# EAGLE design shield-ant (EAGLE 5.06)
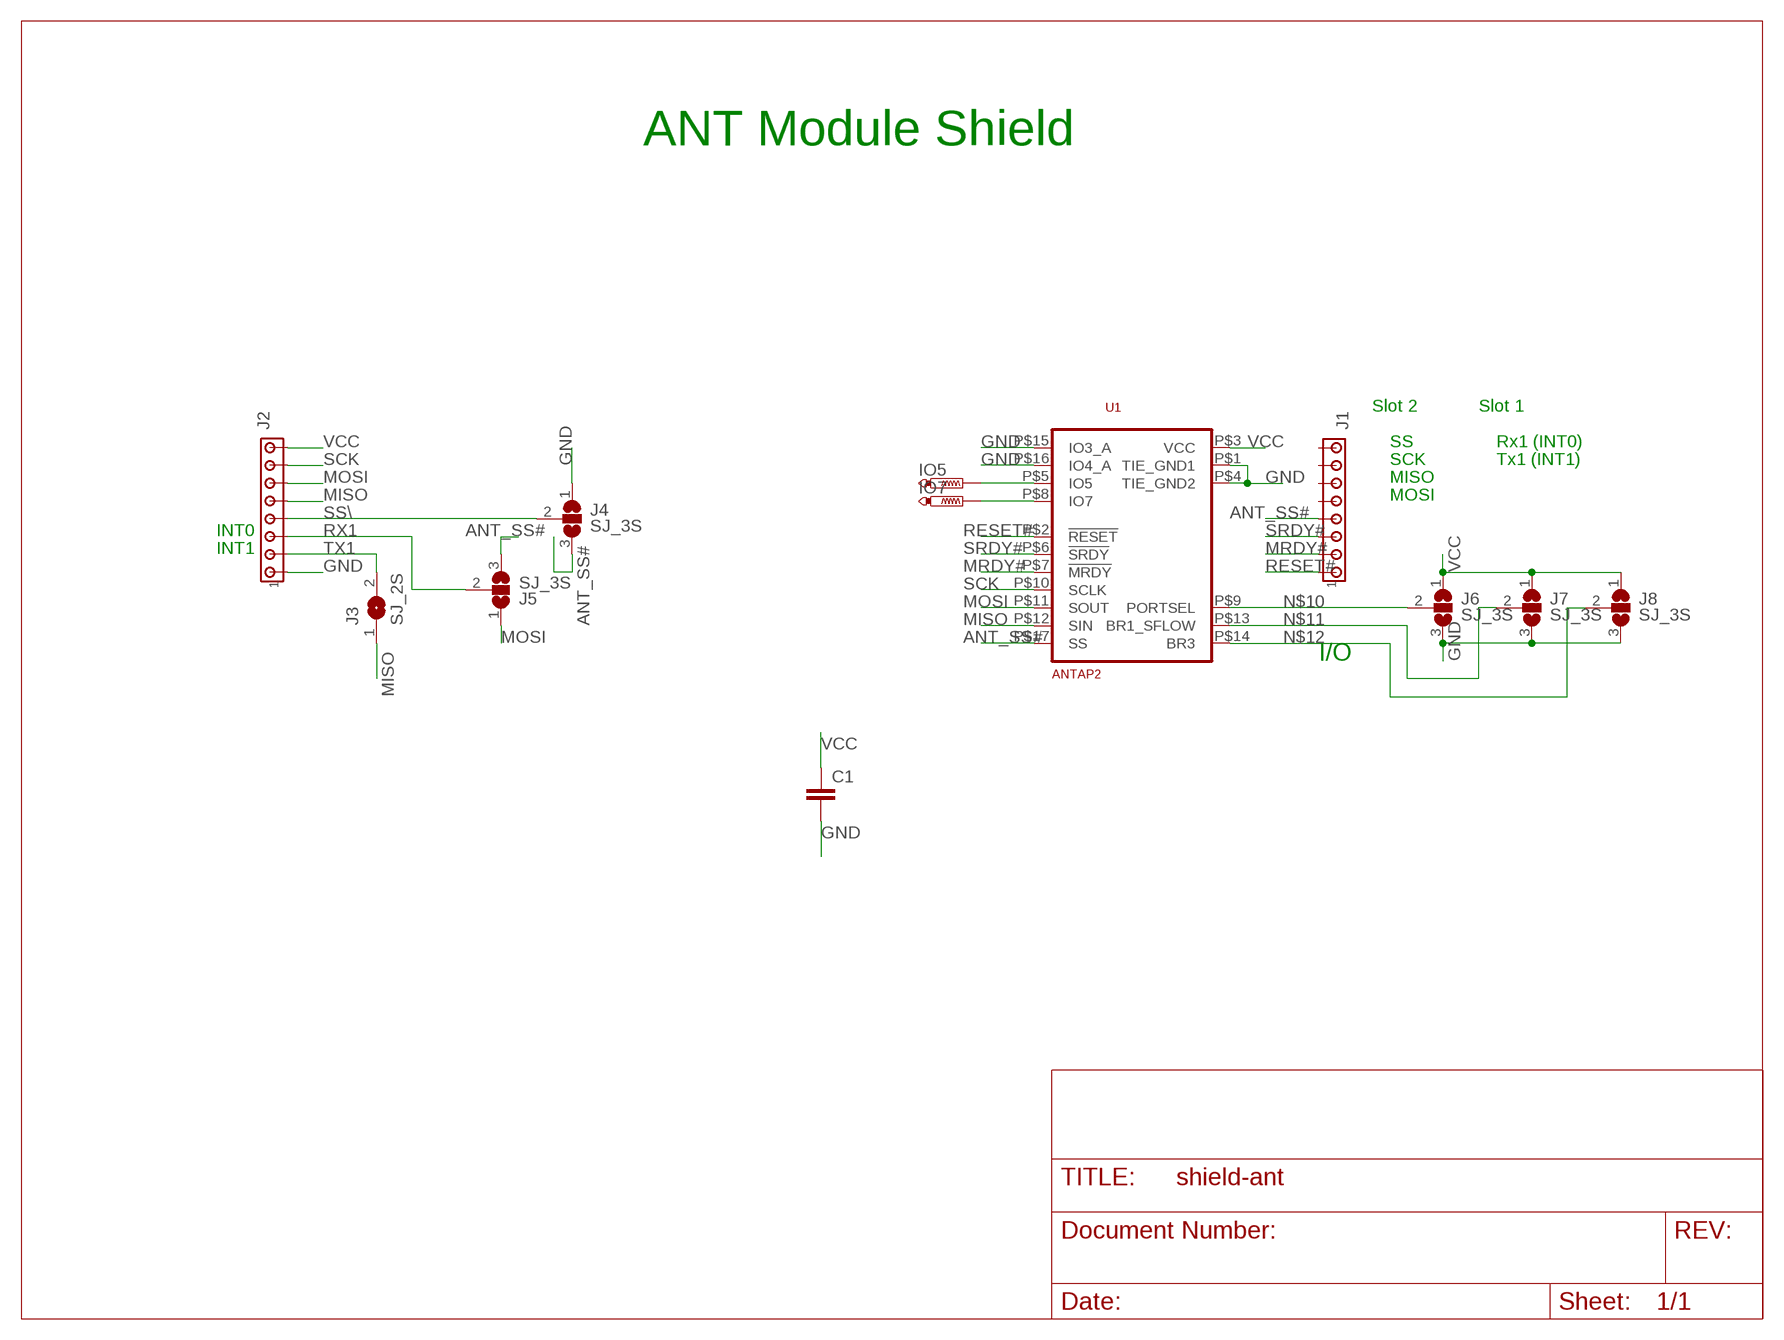
[diagram p0: schematic, sheet 1]

## Parts
C1  C-EUC0805  [C0805]
IO5  PTR1TP15R  [TP15R]
IO7  PTR1TP15R  [TP15R]
J1  MTA08-100  [10X08MTA]
J2  MTA08-100  [10X08MTA]
J3  SJ_2S  [SJ2_S]
J4  SJ_3S  [SJ3_S]
J5  SJ_3S  [SJ3_S]
J6  SJ_3S  [SJ3_S]
J7  SJ_3S  [SJ3_S]
J8  SJ_3S  [SJ3_S]
U1  ANTAP2  ANT21TRXXX  [ANT21TRX3M4_SMD_RESTRICT]

## Nets
ANT_SS#: J1.4 J4.3 J5.3 U1.P$17(SS)
GND: C1.2 J2.1 J4.1 J6.3 J7.3 J8.3 U1.P$1(TIE_GND1) U1.P$4(TIE_GND2) U1.P$15(IO3_A) U1.P$16(IO4_A)
MISO: J2.5 J3.1 U1.P$12(SIN)
MOSI: J2.6 J5.1 U1.P$11(SOUT)
MRDY#: J1.2 U1.P$7(!MRDY)
N$1: IO7.TP U1.P$8(IO7)
N$2: IO5.TP U1.P$5(IO5)
N$10: J6.2 U1.P$9(PORTSEL)
N$11: J7.2 U1.P$13(BR1_SFLOW)
N$12: J8.2 U1.P$14(BR3)
RESET#: J1.1 U1.P$2(!RESET)
RX1: J2.3 J5.2
SCK: J2.7 U1.P$10(SCLK)
SRDY#: J1.3 U1.P$6(!SRDY)
SS\: J2.4 J4.2
TX1: J2.2 J3.2
VCC: C1.1 J2.8 J6.1 J7.1 J8.1 U1.P$3(VCC)
Unconnected: J1.5 J1.6 J1.7 J1.8

## Notes on the sheet
- ANT Module Shield
- Slot 2 | Slot 1
- SS | Rx1 (INT0)
- SCK | Tx1 (INT1)
- MISO
- MOSI
- INT0
- INT1
- I/O

## Library data of the parts
C1 = rcl:C-EU: CAPACITOR, European symbol
IO5 IO7 = testpad:PTR1: TEST PIN
J1 J2 = con-amp:MTA08-100: AMP connector
J3 = mideeval:SJ_2S: Small solder jumper, 2 pin. 20060130 / tgipson
J4-J8 = mideeval:SJ_3S: Small solder jumper, 3 pin. 20060130 / tgipson
U1 = mideeval:ANT21TRXXX

## Net classes
1 pwr: width 0.305 mm, drill 0.508 mm, clearance 0.203 mm
4 digital: width 0.203 mm, drill 0.381 mm, clearance 0.203 mm

## Board
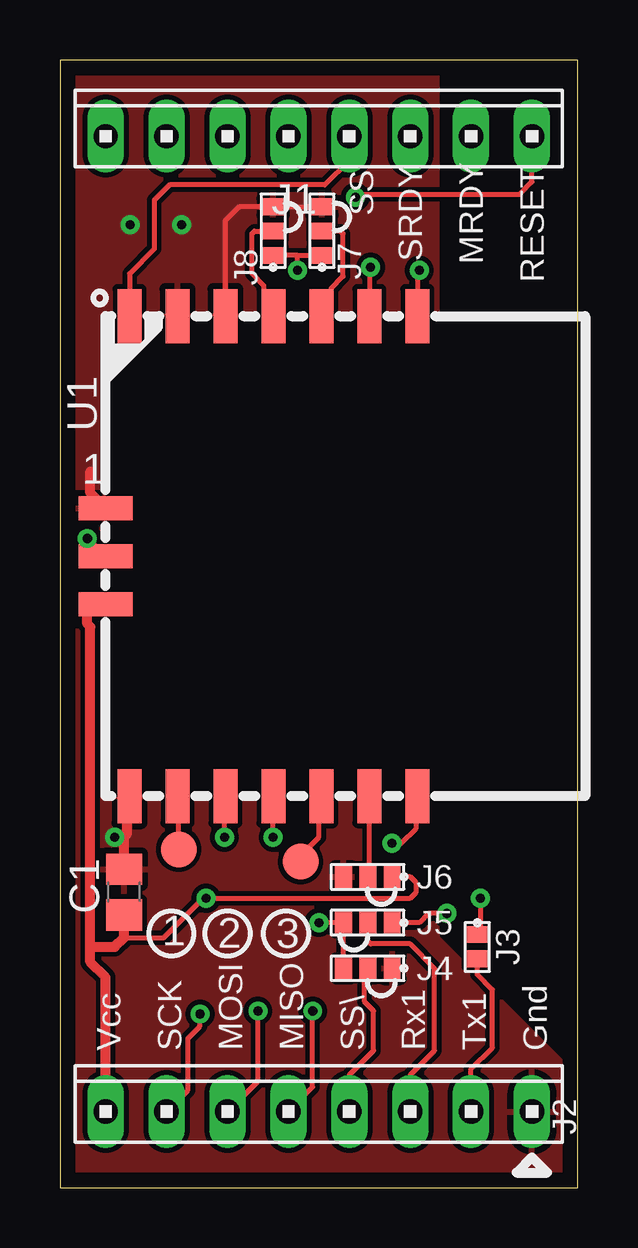
[diagram p1: board, top side]
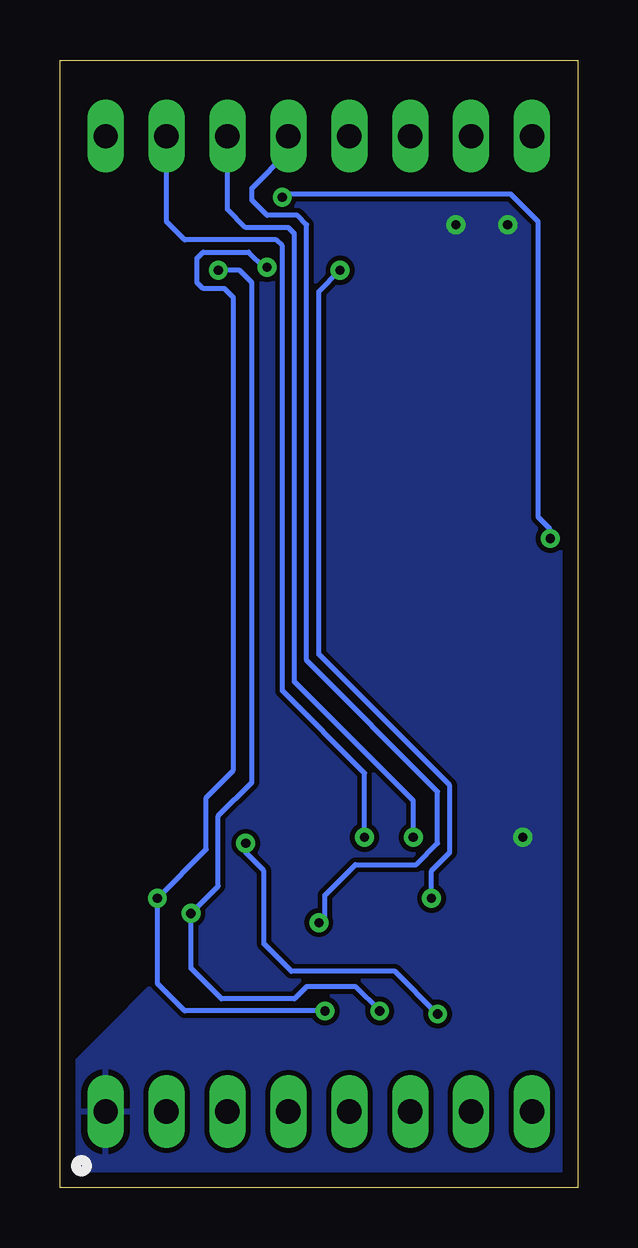
[diagram p2: board, bottom side, seen from below]

Size 21.59 x 46.99 mm. Coordinates in mm from the lower left corner, seen from the top.
Outline: 0,0 21.59,0 21.59,46.99 0,46.99 0,0
Copper layers (1*16): Top 0.035mm / dielectric 1.5mm / Bottom 0.035mm
Design rules "default *": minimum track width 8mil, minimum drill 15mil, track to track 8mil, track to pad 8mil, pad to pad 8mil, via to via 8mil, smd to smd 8mil, copper to edge 25mil, drill to drill 8mil, minimum pad ring 10mil, minimum via ring 8mil, stop-mask expansion 4mil, vias tented up to drill 0mil, thermal gap 10mil

### Footprints (pad centres in the part's own frame; a part is rotated, then mirrored left to right if it is on the bottom)
C0805 = smd 1.3 x 1.5: 1 -0.95,0; 2 0.95,0
TP15R = smd 1.5 x 1.5: TP 0,0
10X08MTA = drill 1.016 long: 1 8.89,0; 2 6.35,0; 3 3.81,0; 4 1.27,0; 5 -1.27,0; 6 -3.81,0; 7 -6.35,0; 8 -8.89,0
SJ2_S = smd 0.7 x 0.9: 1 -0.523,0; 2 0.493,0
SJ3_S = smd 0.7 x 0.9: 1 -1.031,0; 2 -0.015,0; 3 1.001,0
ANT21TRX3M4_SMD_RESTRICT = smd 2.25 x 1: P$1 0,-8; P$2 0,-10; P$3 0,-12 | smd 1 x 2.25: P$4 1,-20; P$5 3,-20; P$6 5,-20; P$7 7,-20; P$8 9,-20; P$9 11,-20; P$10 13,-20; P$11 13,0; P$12 11,0; P$13 9,0; P$14 7,0; P$15 5,0; P$16 3,0; P$17 1,0

### Placement (x,y rotation side)
C1  2.67,12.32 90 top
IO5  4.95,14.1 0 top
IO7  10.03,13.59 0 top
J1  10.79,43.81 0 top
J2  10.79,3.17 0 top
J3  17.4,10.03 270 top
J4  12.83,9.14 180 top
J5  12.83,11.05 180 top
J6  12.83,12.95 180 top
J7  10.92,39.88 90 top
J8  8.89,39.88 90 top
U1  1.91,36.32 0 top

### Tracks (layer width: path | path; a pad name or v marks a point on that pad's centre or on a via)
ANT_SS#  (via drill 0.38)
  Top 0.203: J1.4 12.06,42.8 11.05,41.78 4.57,41.78 3.94,41.15 3.94,39.12 2.9,38.08 U1.P$17 | J4.3 J5.3 v10.79,11.05
  Bottom 0.203: v10.79,11.05 10.54,11.3 10.54,12.19 9.27,13.46 6.73,13.46 5.84,14.35 5.84,16.51 11.3,21.97 11.3,40.13 11.68,40.51 12.95,40.51 13.59,41.15 13.59,41.66 12.06,43.18 J1.4
GND  (via drill 0.38)
  Top 0.203: J7.3 J8.3 8.88,40.89 7.49,40.89 6.91,40.31 U1.P$15
  Top 0.406: C1.2 2.67,14.61 2.79,14.73 2.79,16.21 U1.P$4 | U1.P$1 1.27,28.96 1.27,29.84
  other vias: 2.92,40.13 5.08,40.13 2.29,14.61
  pour Top: 0,0 21.59,0 21.59,4.57 15.75,10.41 15.75,46.99 0,46.99
  pour Bottom: 0,0 21.59,0 21.59,4.57 15.75,10.41 15.75,46.99 0,46.99
MISO  (via drill 0.38)
  Top 0.203: J3.1 17.53,10.68 v17.53,12.06 | J2.5 10.54,4.19 v10.54,7.37 | v12.95,38.35 12.9,38.05 U1.P$12
  Bottom 0.203: v10.54,7.37 16.38,7.37 17.53,8.51 v17.53,12.06 15.49,14.1 15.49,16.26 14.35,17.4 14.35,37.08 14.73,37.47 15.62,37.47 15.88,37.72 15.88,38.73 15.62,38.99 13.72,38.99 13.08,38.35 v12.95,38.35
MOSI  (via drill 0.38)
  Top 0.203: J2.6 8.26,4.45 v8.26,7.37 | v14.99,38.23 14.9,38.53 U1.P$11 | J5.1 14.99,11.05 15.37,11.43 v16.13,11.43
  Bottom 0.203: v8.26,7.37 9.27,8.38 11.3,8.38 11.81,7.87 14.86,7.87 16.13,9.14 v16.13,11.43 14.99,12.57 14.99,15.49 13.59,16.89 13.59,37.72 14.1,38.23 v14.99,38.23
MRDY#  (via drill 0.38)
  Top 0.203: U1.P$7 8.89,16.31 v8.89,14.61
  Bottom 0.203: J1.2 17.14,40.26 16.38,39.5 12.57,39.5 12.32,39.24 12.32,20.7 8.89,17.27 v8.89,14.61
N$1
  Top 0.203: U1.P$8 10.79,16.21 10.79,14.61 9.78,13.59 IO7.TP
N$2
  Top 0.203: U1.P$5 4.95,16.27 IO5.TP
N$10
  Top 0.203: J6.2 12.9,13.02 U1.P$9
N$11
  Top 0.203: J7.2 11.7,39.86 11.81,39.75 11.81,37.97 11.3,37.47 11.3,36.72 U1.P$13
N$12
  Top 0.203: J8.2 8.11,39.86 8,39.75 8,38.1 8.51,37.59 8.51,36.72 U1.P$14
RESET#  (via drill 0.38)
  Top 0.203: U1.P$2 1.18,27.05 v1.14,27.05 | J1.1 19.68,41.91 19.18,41.4 12.57,41.4 v12.32,41.27
  Bottom 0.203: v12.32,41.27 12.06,41.4 2.79,41.4 1.65,40.26 1.65,27.94 1.14,27.43 v1.14,27.05
RX1
  Top 0.203: J5.2 12.83,11.03 12.83,10.29 12.95,10.16 14.61,10.16 15.62,9.14 15.62,5.71 14.61,4.7 J2.3
SCK  (via drill 0.38)
  Top 0.203: U1.P$10 14.86,16.28 14.86,14.99 14.22,14.35 v13.84,14.35 | J2.7 5.33,4.06 5.33,6.22 5.84,6.73 v5.84,7.24
  Bottom 0.203: v5.84,7.24 7.62,9.02 11.94,9.02 13.08,10.16 13.08,13.21 13.84,13.97 v13.84,14.35
SRDY#  (via drill 0.38)
  Top 0.203: U1.P$6 6.86,16.27 v6.86,14.61
  Bottom 0.203: J1.3 14.61,40.77 13.84,40.01 12.06,40.01 11.81,39.75 11.81,21.08 6.86,16.13 v6.86,14.61
SS\
  Top 0.203: J4.2 12.7,9 12.7,7.75 13.08,7.37 13.08,5.71 12.06,4.7 J2.4
TX1
  Top 0.203: J3.2 17.4,8.89 18.03,8.26 18.03,5.84 17.14,4.95 J2.2
VCC  (via drill 0.38)
  Top 0.203: 9.91,38.85 J8.1 | 9.91,38.85 J7.1 | J6.1 14.61,12.95 14.86,12.7 14.86,12.32 14.61,12.06 v6.1,12.06 5.97,12.06 4.32,10.41 2.67,10.41 | v9.91,38.23 9.91,38.85
  Top 0.406: J2.8 1.91,8.76 1.27,9.4 1.27,10.03 | 1.27,10.03 1.27,23.37 1.14,23.5 1.14,24.13 1.27,24.26 1.84,24.26 U1.P$3 | C1.1 2.67,10.41 2.29,10.03 1.27,10.03
  Bottom 0.203: v9.91,38.23 10.79,37.34 10.79,22.23 5.33,16.76 5.33,13.97 6.1,13.21 v6.1,12.06

### Text on the board
tPlace: SS | SRDY | MRDY | RESET | Vcc | SCK | MOSI | MISO | SS\ | Rx1 | Tx1 | Gnd
tNames: 1 | 2 | 3